# EAGLE design power supply 220DC (EAGLE 5.11)
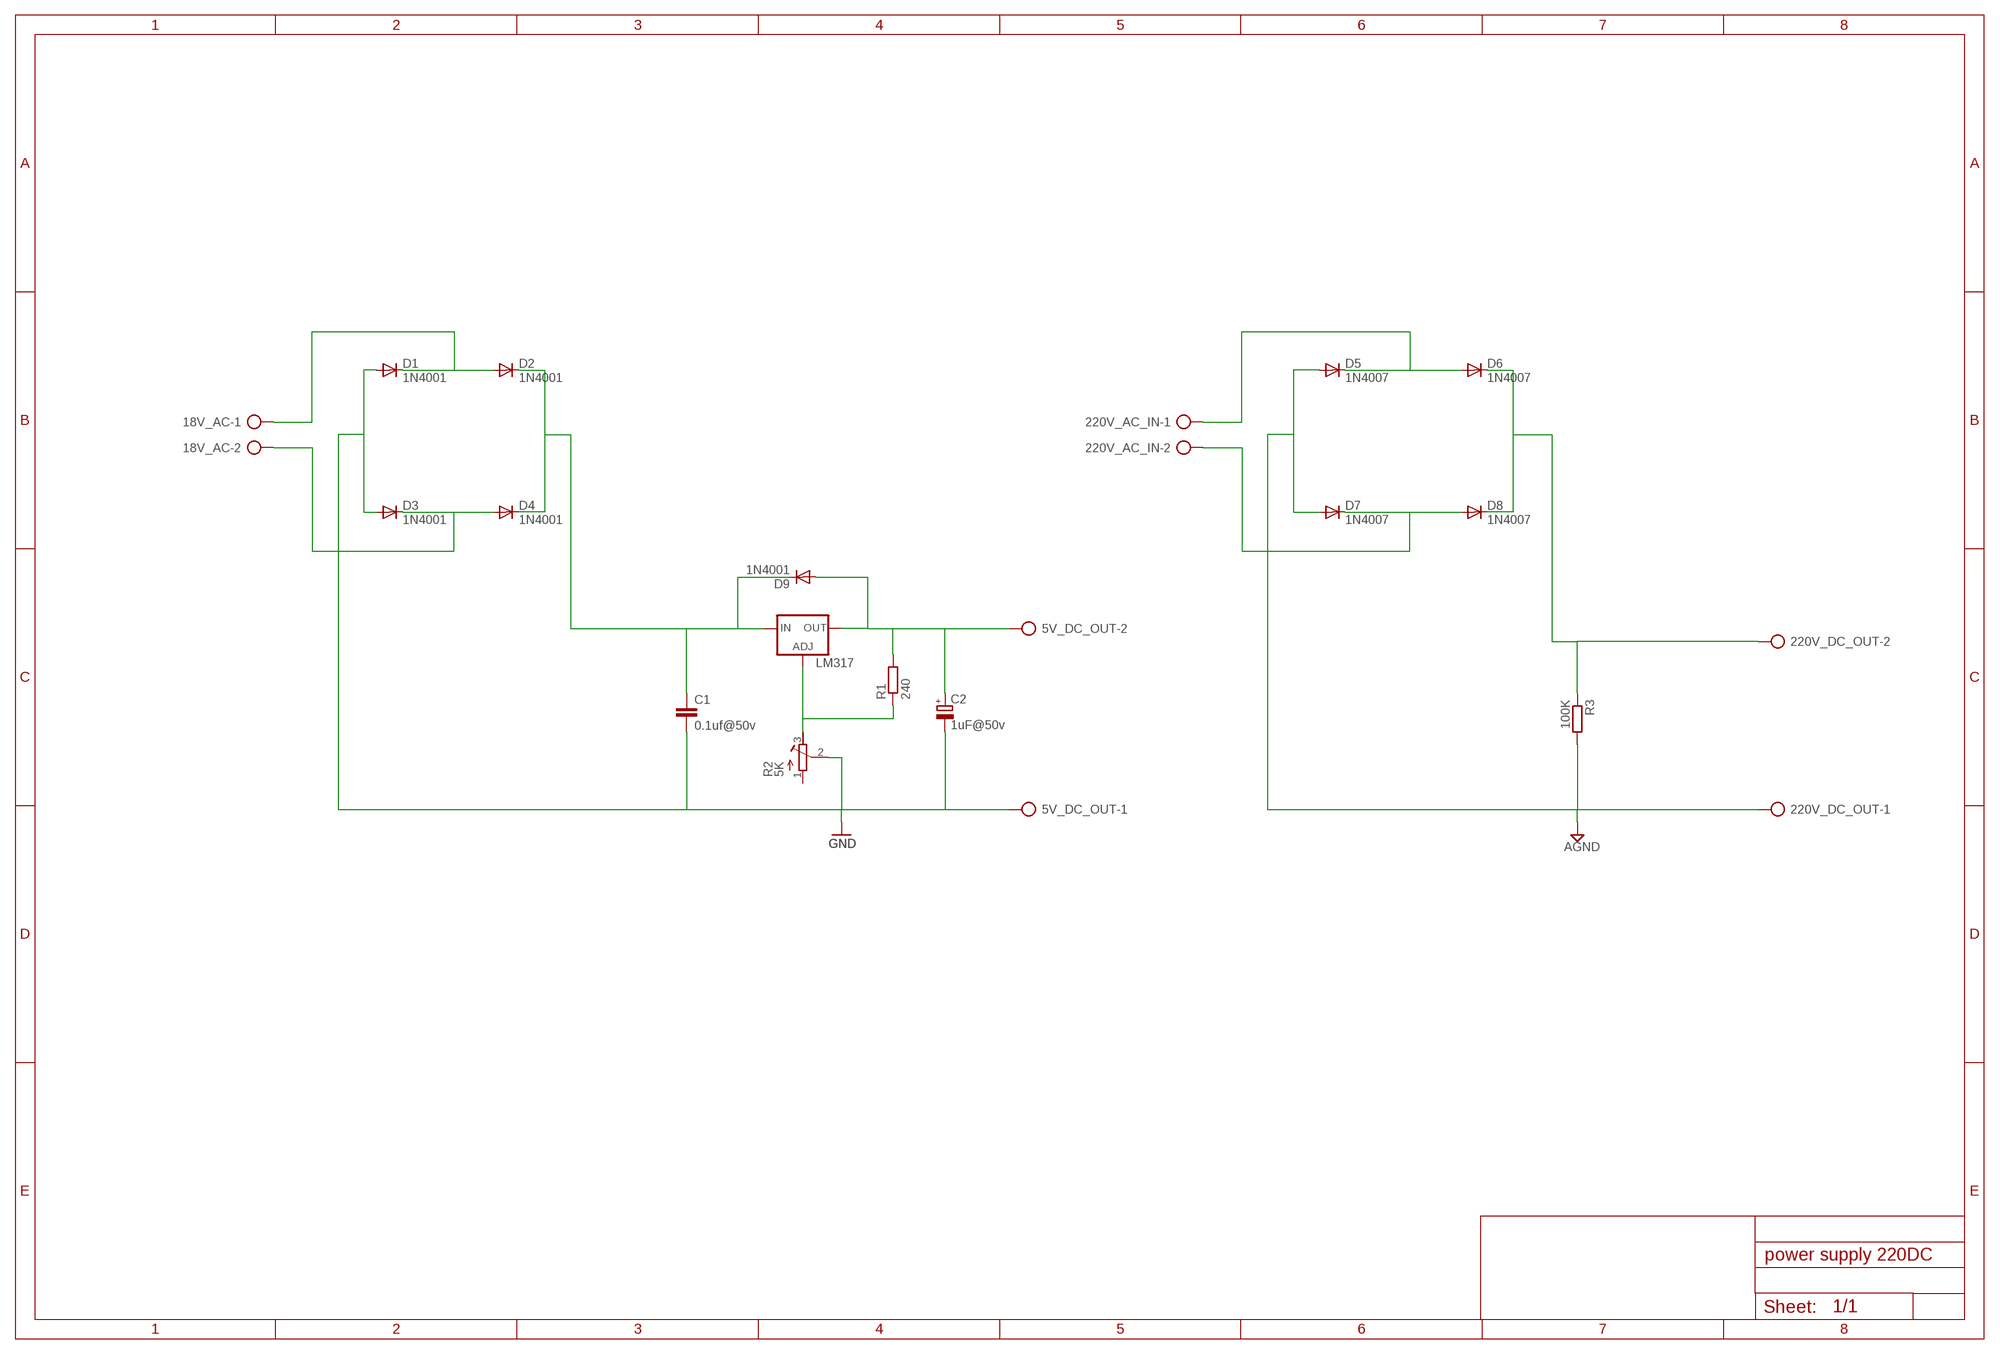
[diagram p0: schematic, sheet 1]

## Parts
5V_DC_OUT  AK300/2  [AK300/2]
18V_AC  AK300/2  [AK300/2]
220V_AC_IN  AK300/2  [AK300/2]
220V_DC_OUT  AK300/2  [AK300/2]
C1  0.1uf@50v  C-EU050-024X044  [C050-024X044]
C2  1uF@50v  CPOL-EUE2.5-6  [E2,5-6]
D1  1N4001  1N4004  [DO41-10]
D2  1N4001  1N4004  [DO41-10]
D3  1N4001  1N4004  [DO41-10]
D4  1N4001  1N4004  [DO41-10]
D5  1N4007  1N4004  [DO41-10]
D6  1N4007  1N4004  [DO41-10]
D7  1N4007  1N4004  [DO41-10]
D8  1N4007  1N4004  [DO41-10]
D9  1N4001  1N4004  [DO41-10]
LM317  LM317TL  [317TL]
R1  240  R-EU_0207/10  [0207/10]
R2  5K  R-TRIMM64W  [RTRIM64W]
R3  100K  R-EU_0411/12  [0411/12]

## Nets
AGND: 220V_DC_OUT.1 D5.A D7.A R3.2
GND: 5V_DC_OUT.1 C1.2 C2.- D1.A D3.A R2.2(S)
N$1: 18V_AC.1 D1.C D2.A
N$2: 18V_AC.2 D3.C D4.A
N$3: 220V_AC_IN.1 D5.C D6.A
N$4: 220V_AC_IN.2 D7.C D8.A
N$6: C1.1 D2.C D4.C D9.C LM317.3(IN)
N$8: 220V_DC_OUT.2 D6.C D8.C R3.1
N$10: 5V_DC_OUT.2 C2.+ D9.A LM317.2(OUT) R1.2
N$11: LM317.1(ADJ) R1.1 R2.3(A)
Unconnected: R2.1(E)

## Library data of the parts
5V_DC_OUT 18V_AC 220V_AC_IN 220V_DC_OUT = con-ptr500:AK300/2: CONNECTOR; OC_FARNELL: unknown; OC_NEWARK: unknown
C1 = rcl:C-EU: CAPACITOR, European symbol
C2 = rcl:CPOL-EU: POLARIZED CAPACITOR, European symbol
D1-D9 = diode:1N4004: DIODE general purpose rectifier, 1 A
LM317 = v-reg:LM317TL: VOLTAGE REGULATOR
R1 R3 = rcl:R-EU_: RESISTOR, European symbol
R2 = rcl:R-TRIMM: Trimm resistor

## Board
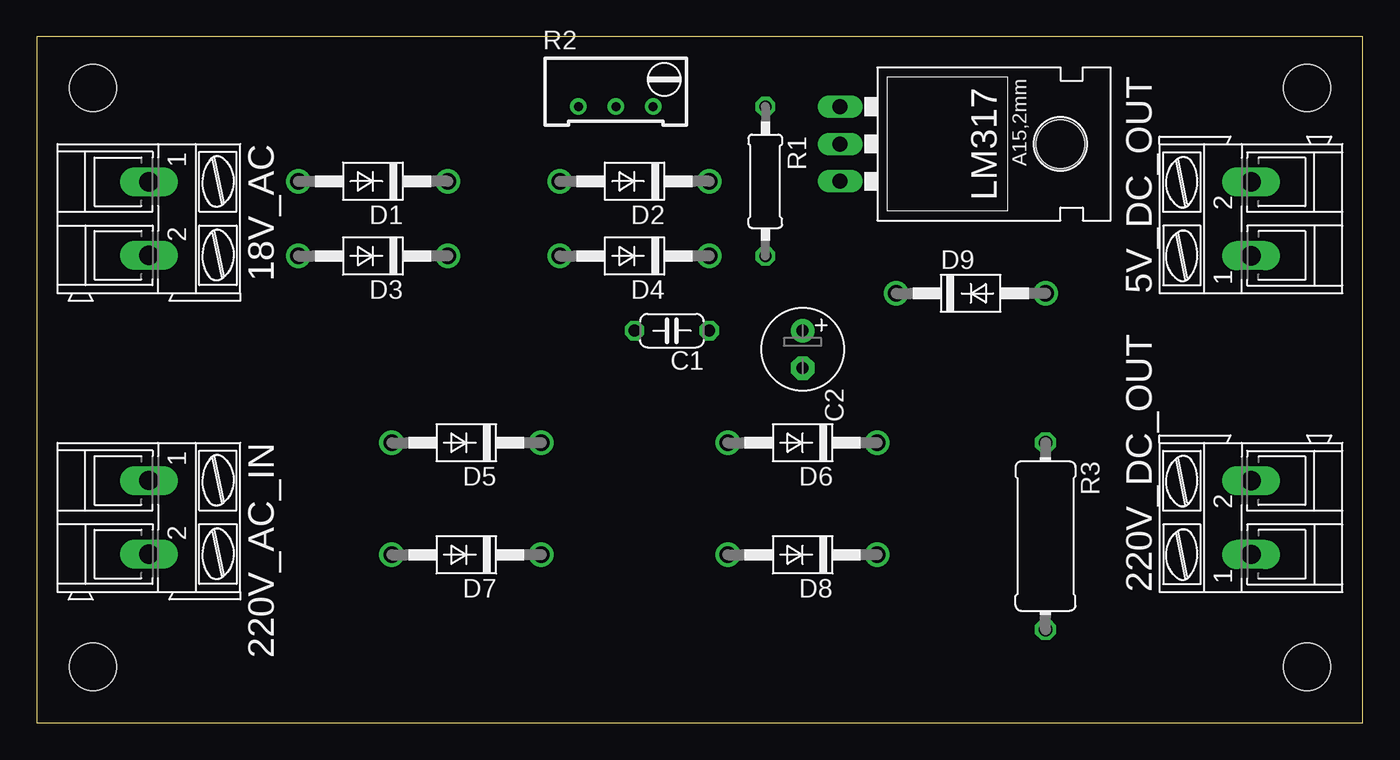
[diagram p1: board, top side]
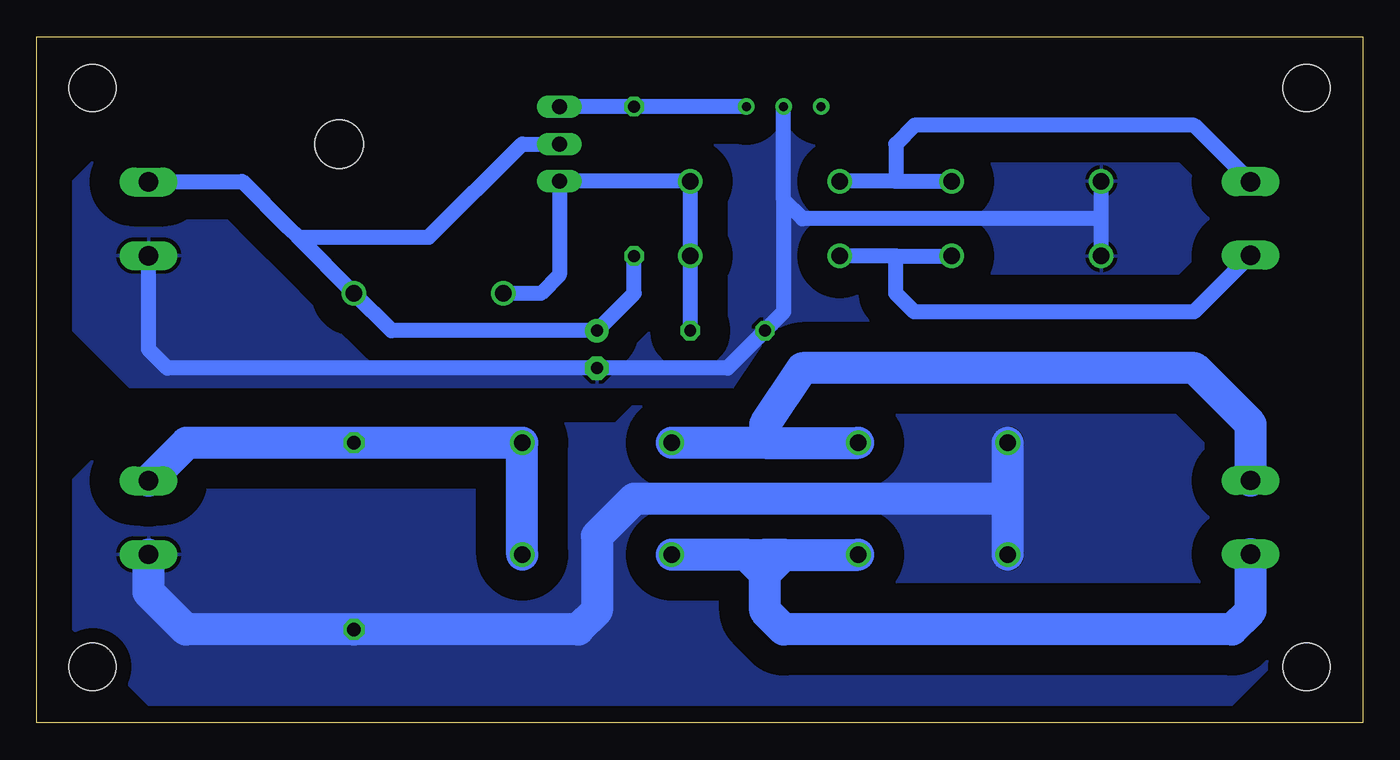
[diagram p2: board, bottom side, seen from below]

Size 90.15 x 46.66 mm. Coordinates in mm from the lower left corner, seen from the top.
Outline: 0,0 90.15,0 90.15,46.66 0,46.66 0,0
Copper layers (1*16): Top 0.035mm / dielectric 1.5mm / Bottom 0.035mm
Design rules "default *": minimum track width 10mil, minimum drill 24mil, track to track 80mil, track to pad 40mil, pad to pad 80mil, via to via 80mil, smd to smd 8mil, copper to edge 40mil, drill to drill 8mil, minimum pad ring 10mil, minimum via ring 8mil, stop-mask expansion 4mil, vias tented up to drill 0mil, thermal gap 10mil
Holes 3.2 mm at 3.81,3.81 3.81,43.18 86.36,43.18 86.36,3.81

### Footprints (pad centres in the part's own frame; a part is rotated, then mirrored left to right if it is on the bottom)
AK300/2 = drill 1.321 long: 1 -2.515,0; 2 2.489,0
C050-024X044 = drill 0.813 octagon: 1 -2.54,0; 2 2.54,0
E2,5-6 = drill 0.813 pad 1.6 round: + -1.27,0 | drill 0.813 pad 1.6 octagon: - 1.27,0
DO41-10 = drill 1.118 round: A 5.08,0; C -5.08,0
317TL = drill 1.016 long: 1 -2.54,-3.81; 2 0,-3.81; 3 2.54,-3.81 | hole 3.302: 0,11.176
0207/10 = drill 0.813 octagon: 1 -5.08,0; 2 5.08,0
RTRIM64W = drill 0.61 round: 1 1.27,-2.54; 2 1.27,0; 3 1.27,2.54
0411/12 = drill 0.914 octagon: 1 -6.35,0; 2 6.35,0

### Placement (x,y rotation side)
5V_DC_OUT  82.55,34.29 90 top
18V_AC  7.62,34.29 270 top
220V_AC_IN  7.62,13.97 270 top
220V_DC_OUT  82.55,13.97 90 top
C1  43.18,26.67 180 top
C2  52.07,25.4 270 top
D1  22.86,36.83 180 top
D2  40.64,36.83 180 top
D3  22.86,31.75 180 top
D4  40.64,31.75 180 top
D5  29.21,19.05 180 top
D6  52.07,19.05 180 top
D7  29.21,11.43 180 top
D8  52.07,11.43 180 top
D9  63.5,29.21 0 top
LM317  58.42,39.37 270 top
R1  49.53,36.83 270 top
R2  39.37,43.18 270 top
R3  68.58,12.7 270 top

### Tracks (layer width: path | path; a pad name or v marks a point on that pad's centre or on a via)
AGND
  Bottom 2.184: 24.13,15.24 D5.A | D7.A 24.13,15.24 | 24.13,15.24 49.53,15.24 52.07,12.7 52.07,7.62 53.34,6.35 R3.2 80.01,6.35 82.55,8.89 220V_DC_OUT.1
  pour Bottom: 3.81,24.13 3.81,6.35 8.89,1.27 82.55,1.27 87.63,6.35 87.63,16.51 83.82,20.32 50.8,20.32 49.53,21.59 43.18,21.59 39.37,25.4 5.08,25.4
GND
  Bottom 1.016: D3.A 17.78,34.29 | 17.78,34.29 D1.A | 17.78,34.29 38.1,34.29 39.37,35.56 | 39.37,35.56 R2.2 | 39.37,35.56 39.37,27.94 C1.2 43.18,24.13 C2.- 81.28,24.13 82.55,25.4 5V_DC_OUT.1
  pour Bottom: 10.16,44.45 8.89,44.45 2.54,38.1 2.54,31.75 7.62,26.67 38.1,26.67 41.91,22.86 83.82,22.86 87.63,26.67 87.63,36.83 80.01,44.45
N$1
  Bottom 1.016: 18V_AC.1 11.46,40.64 30.48,40.64 31.75,39.37 31.75,36.83 | 31.75,36.83 D1.C | 31.75,36.83 D2.A
N$2
  Bottom 1.016: 31.75,31.75 D3.C | 31.75,31.75 D4.A | 18V_AC.2 11.48,27.94 30.48,27.94 31.75,29.21 31.75,31.75
N$3
  Bottom 2.184: 40.64,19.05 40.64,20.32 38.1,24.13 11.43,24.13 7.62,20.32 220V_AC_IN.1 | 40.64,19.05 D5.C | 40.64,19.05 D6.A
N$4
  Bottom 2.184: 40.64,10.16 40.64,7.62 39.37,6.35 8.89,6.35 7.62,7.62 220V_AC_IN.2 | 39.37,11.43 D7.C | 40.64,10.16 39.37,11.43 | 39.37,11.43 40.64,11.43 | 41.91,11.43 40.64,11.43 | 40.64,10.16 41.91,11.43 | 40.64,10.16 40.64,11.43 | 41.91,11.43 D8.A
N$6
  Bottom 1.016: C1.1 D4.C D2.C LM317.3 54.61,30.48 55.88,29.21 D9.C
N$8
  Bottom 2.184: D8.C D6.C R3.1 79.96,19.05 220V_DC_OUT.2
N$10
  Bottom 1.016: LM317.2 57.15,39.37 63.5,33.02 72.39,33.02 | R1.2 49.53,29.21 C2.+ 66.04,26.67 D9.A 72.39,33.02 | 5V_DC_OUT.2 76.25,36.78 76.2,36.83 73.03,33.66 72.39,33.02
N$11
  Bottom 1.016: R2.3 R1.1 LM317.1